# EasyEDA Pro project Modular-USB-Hub (All PCBs).epro

# Board PCB1
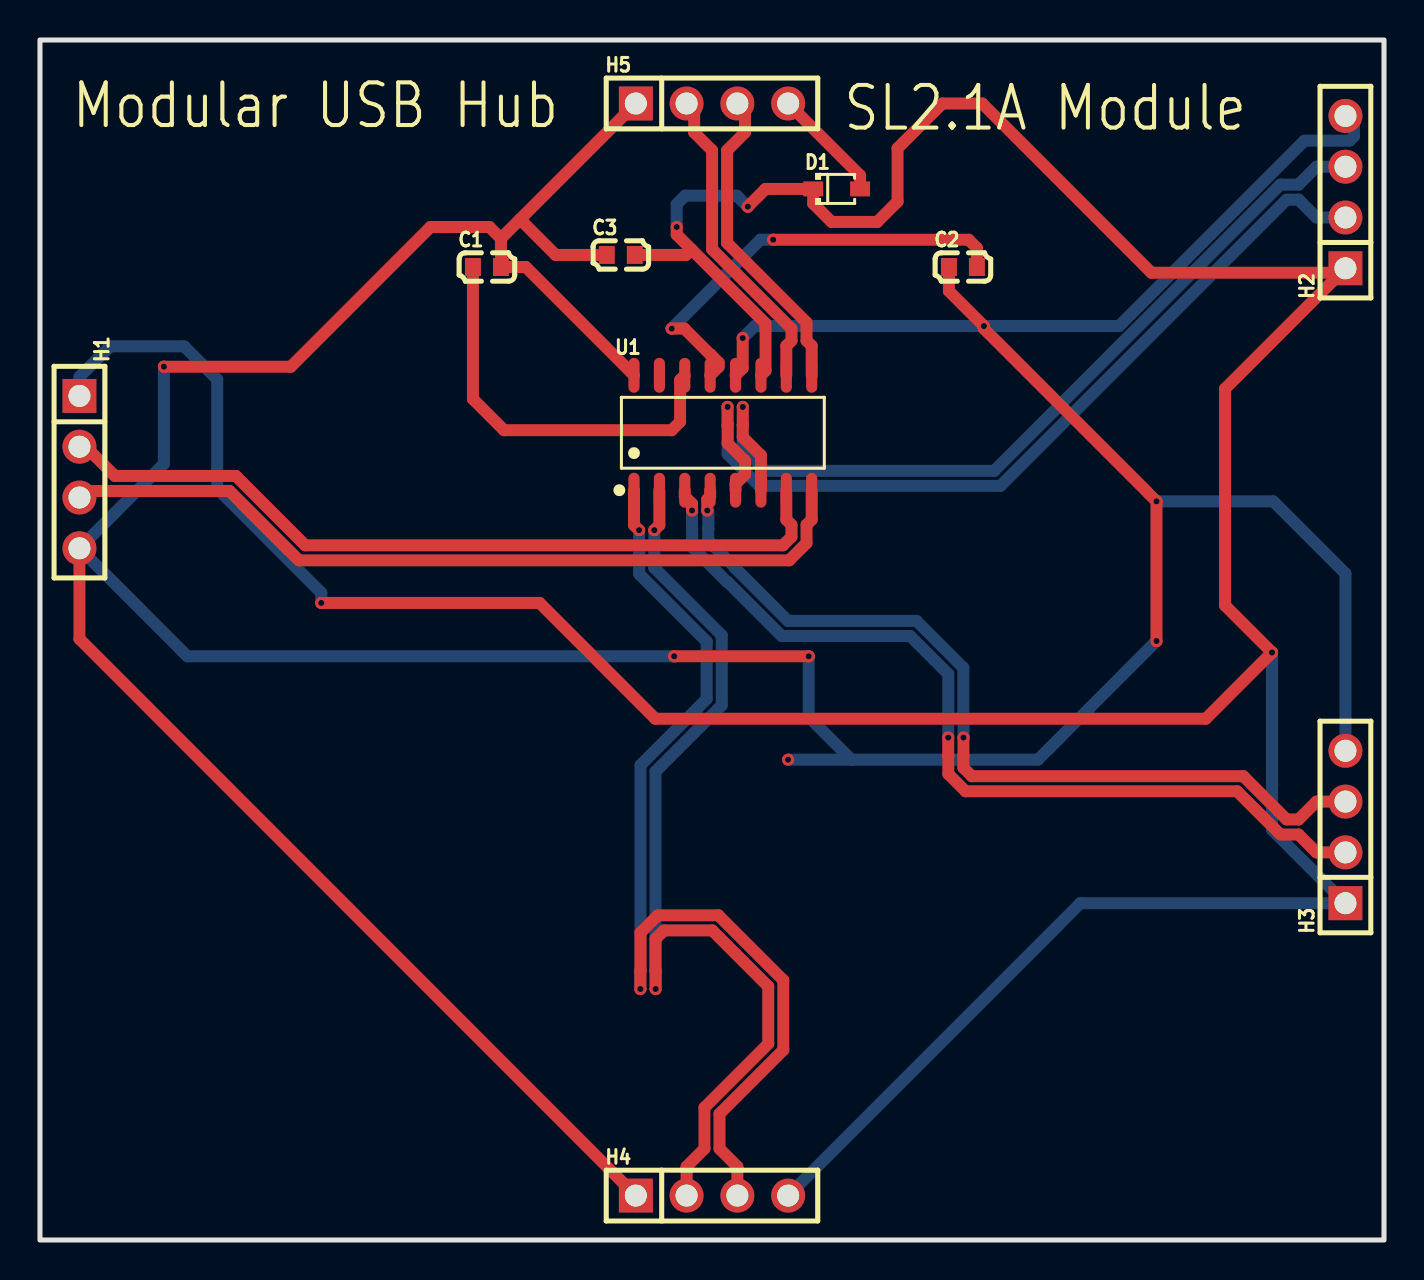
[diagram p0: board, top side]
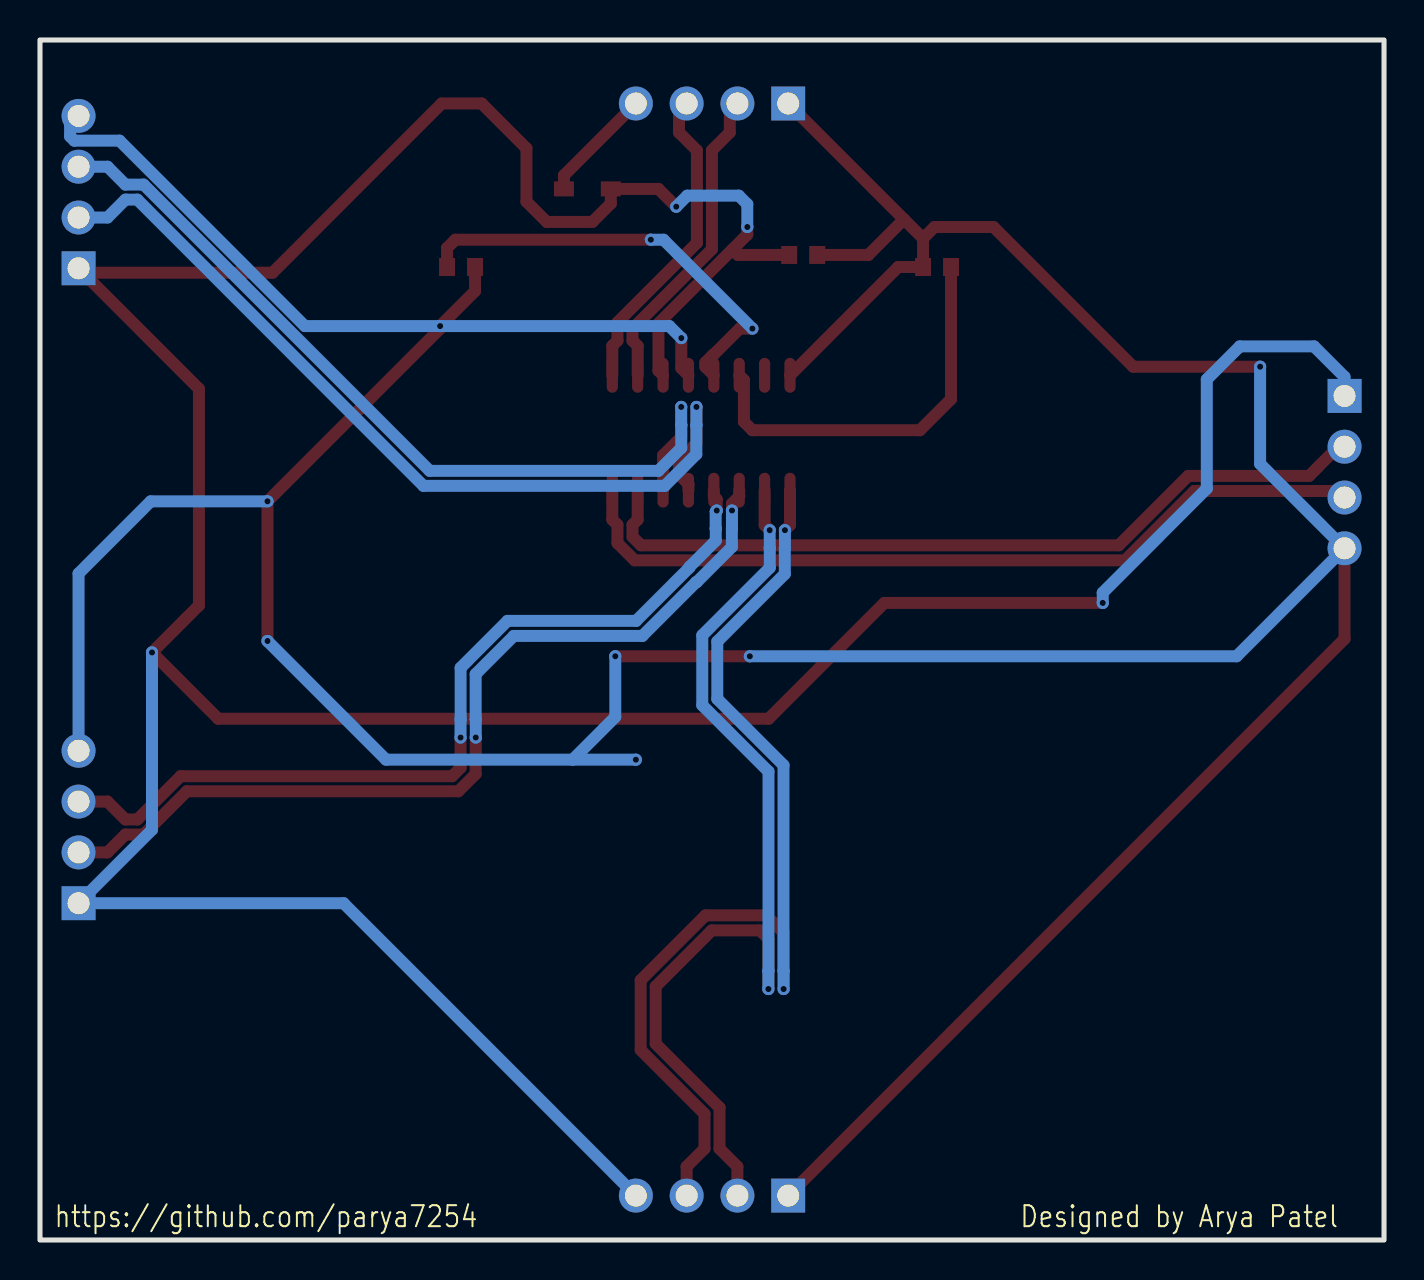
[diagram p1: board, bottom side, seen from below]

Outline 67.24 x 60 mm; copper layers: Top Layer, Bottom Layer. Coordinates in mm from the lower left corner of the outline.
Outline path: rectangle 0,60 67.24,0
Stack: Top Layer 0.035mm / Dielectric1 1.51mm FR4 er 4.5 / Bottom Layer 0.035mm

## Design rules (mm)
net M1: DP2
net P1: DP2
net M2: DP3
net P2: DP3
net M3: DP4
net P3: DP4
net M4: DP5
net P4: DP5
net $1N502: DP1
net $1N508: DP1
template: Custom Config
spacing copperThickness1oz (default): track to track 0.102, other pairs 0.152 to 0.3
spacing copperThickness2oz: track to track 0.203, other pairs 0.152 to 0.3
track width copperThickness1oz (default): min 0.127, default 0.254, max 2.54
track width copperThickness2oz: min 0.203, default 0.254, max 2.54
differential pair differentialPair (default): width min 0.127, default 0.254, max 2.54; gap min 0.152, default 0.152
via viaSize (default): diameter min 0.5, default 0.61, max 10; hole min 0.3, default 0.305, max 6.3

## Placement (name value [footprint] x y rotation side)
C1  10uF  [C0603]  22.36 48.65 0 top
C2  10uF  [C0603]  46.17 48.65 0 top
C3  10uF  [C0603]  29.06 49.25 0 top
D1  NSR0320MW2T1G  [SOD-323_L1.8-W1.3-LS2.5-RD]  39.85 52.55 0 top
H1  2.54-1*4P母  [HDR-TH_4P-P2.54-V-F]  1.98 38.39 270 top
H2  2.54-1*4P母  [HDR-TH_4P-P2.54-V-F]  65.31 52.39 90 top
H3  2.54-1*4P母  [HDR-TH_4P-P2.54-V-F]  65.31 20.65 90 top
H4  2.54-1*4P母  [HDR-TH_4P-P2.54-V-F]  33.62 2.22 0 top
H5  2.54-1*4P母  [HDR-TH_4P-P2.54-V-F]  33.62 56.83 0 top
U1  SL2.1A  [SOP-16_L10.0-W3.9-P1.27-LS6.0-BL]  34.16 40.36 0 top

## Footprints (pads in the part's own frame, mm; a bottom-side part is the same pattern mirrored in y, then rotated)
C0603
  rect 0.8x0.9 smd: 1(-0.7,0) 2(0.7,0)
HDR-TH_4P-P2.54-V-F
  rect 1.7x1.7 hole 1.1: 1(-3.81,0)
  round 1.7 hole 1.1: 2(-1.27,0) 3(1.27,0) 4(3.81,0)
SOD-323_L1.8-W1.3-LS2.5-RD
  rect 1x0.75 smd: 1(-1.173,0) 2(1.173,0)
SOP-16_L10.0-W3.9-P1.27-LS6.0-BL
  oval 0.56x1.745 smd: 1(-4.445,-2.873) 2(-3.175,-2.873) 3(-1.905,-2.873) 4(-0.635,-2.873) 5(0.635,-2.873) 6(1.905,-2.873) 7(3.175,-2.873) 8(4.445,-2.873) 9(4.445,2.873) 10(3.175,2.873) 11(1.905,2.873) 12(0.635,2.873) 13(-0.635,2.873) 14(-1.905,2.873) 15(-3.175,2.873) 16(-4.445,2.873)

## Nets
+5V: C3.2 D1.1 H1.1 H2.1 H3.1 H4.4 U1.11
GND: C1.2 C2.1 C3.1 H1.4 H2.4 H3.4 H4.1 H5.1 U1.12 U1.16
M1: H1.2 U1.7
M2: H2.2 U1.5
M3: H3.2 U1.3
M4: H4.3 U1.1
P1: H1.3 U1.8
P2: H2.3 U1.6
P3: H3.3 U1.4
P4: H4.2 U1.2
$1N261: C1.1 U1.14
$1N262: C2.2 U1.13
$1N502: H5.2 U1.10
$1N508: H5.3 U1.9
$1N3196: D1.2 H5.4

Pads without a net: U1 15

## Via types
v1: diameter 0.61, hole 0.305, Top Layer to Bottom Layer, 24 vias

## Routing (per net, layer and track width the routed paths; a pad name or vN(x,y) marks a point on that pad's centre or on a via; arc(x,y) is an arc through that point)
+5V: length 200.6
  Top Layer w0.6: 65.09,48.36 H2.1 ; 65.09,48.36 59.29,42.56 59.29,31.73 v1(61.64,29.38) 58.32,26.06 30.79,26.06 25,31.85 v1(14.07,31.85) ; 65.09,48.36 55.6,48.36 47.14,56.83 45.14,56.83 42.9,54.59 42.9,51.92 41.89,50.9 39.6,50.9 38.68,51.82 D1.1 36.3,52.55 v1(35.41,51.67) ; v1(31.85,50.65) 31.85,50.27 32.6,49.53 ; 32.6,49.53 36.3,45.82 36.3,43.47 U1.11 ; 32.6,49.53 32.32,49.25 C3.2
  Bottom Layer w0.6: H4.4 52.05,16.84 H3.1 61.64,20.51 v1(61.64,29.38) ; v1(35.41,51.67) 34.86,52.22 32.28,52.22 31.85,51.79 v1(31.85,50.65) ; v1(14.07,31.85) 14.07,32.36 8.87,37.57 8.87,43.03 7.22,44.68 3.5,44.68 1.98,43.16 H1.1
GND: length 246.1
  Top Layer w0.6: 24.02,51.03 25.8,49.25 C3.1 ; 24.02,51.03 29.81,56.83 ; 24.02,51.03 23.06,50.08 ; 23.06,50.08 22.49,50.65 19.53,50.65 12.55,43.66 v1(6.2,43.66) ; 23.06,50.08 C1.2 24.3,48.65 U1.16 ; v1(31.73,29.19) v1(38.46,29.19) ; v1(35.16,45.1) 35.16,43.59 U1.12 ; H4.1 1.98,30.05 H1.4 ; C2.1 45.47,47.44 v1(47.22,45.7) 47.22,45.57 v1(55.86,36.93) v1(55.86,29.95)
  Bottom Layer w0.6: 40.59,24.02 49.92,24.02 v1(55.86,29.95) ; 40.59,24.02 v1(37.43,24.02) ; 40.59,24.02 38.46,26.15 v1(38.46,29.19) ; v1(55.86,36.93) 61.7,36.93 65.31,33.32 65.31,24.46 ; v1(6.2,43.66) 6.2,38.81 H1.4 7.37,29.19 v1(31.73,29.19) ; v1(35.16,45.1) 35.76,45.7 v1(47.22,45.7) 53.99,45.7 63.26,54.97 65.52,54.97 65.73,55.18 65.73,55.78 H2.4
M1: length 40.3
  Top Layer w0.6: U1.7 37.34,36.02 37.6,35.76 37.6,35.16 37.17,34.73 13.27,34.73 9.8,38.2 3.75,38.2 2.29,39.66 H1.2
M2: length 45
  Top Layer w0.6: U1.5 34.8,37.8 35.28,38.28 35.28,38.96 34.4,39.83 34.4,40.74 34.4,40.75 v1(34.4,41.65)
  Bottom Layer w0.6: 65.31,51.12 63.86,51.12 62.96,52.02 62.36,52.02 48.05,37.7 35.99,37.7 34.4,39.29 34.4,40.74 34.4,40.75 v1(34.4,41.65)
M3: length 44.9
  Top Layer w0.6: v1(45.44,25.12) 45.44,24.22 45.44,24.21 45.44,23.3 46.31,22.44 59.89,22.44 62.05,20.27 62.96,20.27 63.86,19.38 65.31,19.38 ; v1(32.62,36.47) 32.62,36.82 32.26,37.18 U1.3
  Bottom Layer w0.6: v1(32.62,36.47) 32.62,35.57 32.62,35.56 32.62,34.65 34.38,32.89 34.41,32.89 37.1,30.2 43.54,30.2 45.44,28.3 45.44,26.03 45.44,26.03 v1(45.44,25.12)
M4: length 51.9
  Top Layer w0.6: H4.3 34.89,3.67 33.99,4.56 33.99,6.31 37.19,9.5 37.19,12.99 33.94,16.23 30.91,16.23 30.04,15.37 30.04,13.46 30.04,13.45 v1(30.04,12.55) ; v1(29.97,35.49) 29.72,35.75 U1.1
  Bottom Layer w0.6: v1(30.04,12.55) 30.04,13.45 30.04,13.46 30.04,23.74 33.35,27.05 33.35,29.92 29.98,33.3 29.98,34.58 29.97,34.59 v1(29.97,35.49)
P1: length 41.1
  Top Layer w0.6: 1.98,37.12 2.29,37.12 2.61,37.45 9.49,37.45 12.96,33.98 37.48,33.98 38.35,34.85 38.35,35.76 38.61,36.02 U1.8
P2: length 43.5
  Top Layer w0.6: v1(35.16,41.65) 35.16,40.75 35.16,40.74 35.16,40.14 36.07,39.23 U1.6
  Bottom Layer w0.6: v1(35.16,41.65) 35.16,40.75 35.16,40.74 35.16,39.6 36.3,38.46 47.74,38.46 62.05,52.77 62.96,52.77 63.86,53.66 H2.3
P3: length 43.6
  Top Layer w0.6: H3.3 63.86,21.92 62.96,21.03 62.36,21.03 60.2,23.19 46.62,23.19 46.2,23.61 46.2,24.21 46.2,24.22 v1(46.2,25.12) ; U1.4 33.53,37.18 33.38,37.03 v1(33.38,36.47)
  Bottom Layer w0.6: v1(33.38,36.47) 33.44,36.42 33.44,35.57 33.43,35.57 33.43,34.97 34.75,33.65 34.75,33.62 37.42,30.95 43.85,30.95 46.2,28.61 46.2,26.03 46.2,26.03 v1(46.2,25.12)
P4: length 49.5
  Top Layer w0.6: H4.2 32.35,3.67 33.24,4.56 33.24,6.62 36.43,9.81 36.43,12.68 33.63,15.48 31.22,15.48 30.79,15.06 30.79,13.46 30.8,13.45 v1(30.8,12.55) ; U1.2 30.99,35.75 v1(30.73,35.49)
  Bottom Layer w0.6: v1(30.8,12.55) 30.8,13.45 30.79,13.46 30.79,23.43 34.11,26.74 34.11,30.24 30.73,33.61 30.73,34.58 30.73,34.59 v1(30.73,35.49)
$1N261: length 20.2
  Top Layer w0.6: C1.1 21.66,42.05 23.22,40.49 31.6,40.49 32.02,40.91 32.02,43 U1.14
$1N262: length 22.1
  Top Layer w0.6: v1(31.6,45.57) 32.23,45.57 33.54,44.26 33.57,44.26 33.95,43.88 33.95,43.66 U1.13 ; v1(36.68,50.01) 46.46,50.01 46.87,49.6 C2.2
  Bottom Layer w0.6: v1(31.6,45.57) 36.04,50.01 v1(36.68,50.01)
$1N502: length 15.7
  Top Layer w0.6: 32.73,56.83 32.73,55.38 33.62,54.48 33.62,49.54 37.6,45.57 37.6,44.97 37.34,44.71 U1.10
$1N508: length 15.7
  Top Layer w0.6: 35.27,56.83 35.27,55.38 34.38,54.48 34.38,49.85 38.35,45.88 38.35,44.97 38.61,44.71 U1.9
$1N3196: length 5.8
  Top Layer w0.6: D1.2 41.03,53.23 H5.4

## Text on the board
Bottom Silkscreen Layer: Designed by Arya Patel | https://github.com/parya7254
Top Silkscreen Layer: Modular USB Hub | SL2.1A Module

# Board PCB2
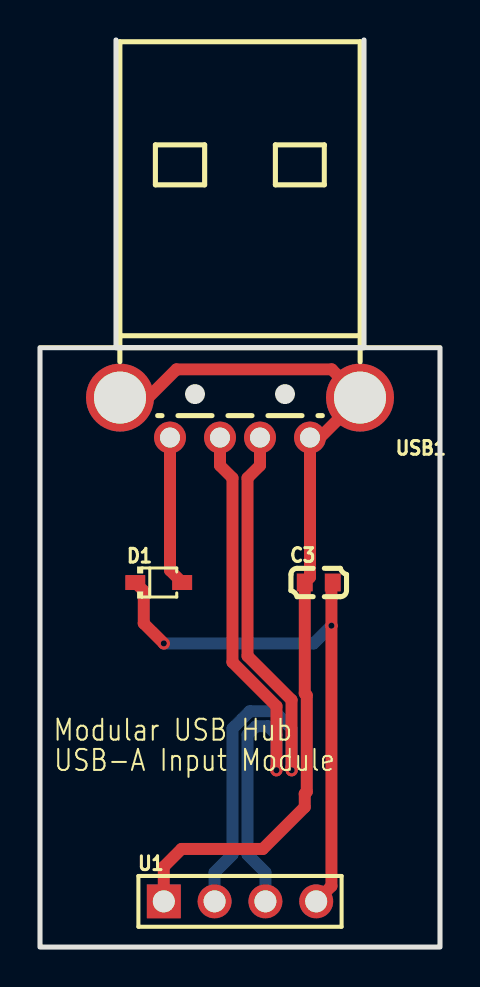
[diagram p2: board, top side]
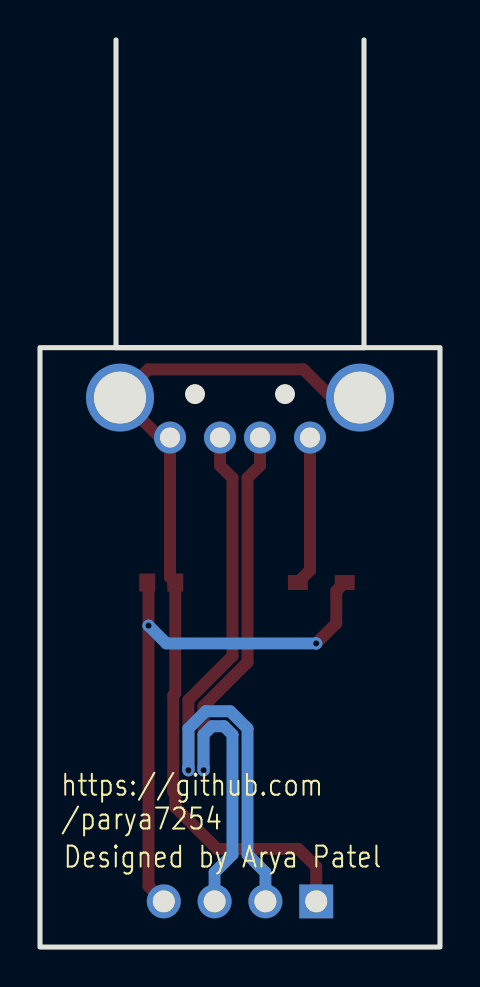
[diagram p3: board, bottom side, seen from below]

Outline 20 x 45.4 mm; copper layers: Top Layer, Bottom Layer. Coordinates in mm from the lower left corner of the outline.
Outline path: rectangle 0,30 20,0
Stack: Top Layer 0.035mm / Dielectric1 1.51mm FR4 er 4.5 / Bottom Layer 0.035mm

## Design rules (mm)
net $1N619: DP1
net $1N627: DP1
template: Custom Config
spacing copperThickness1oz (default): track to track 0.102, other pairs 0.152 to 0.3
spacing copperThickness2oz: track to track 0.203, other pairs 0.152 to 0.3
track width copperThickness1oz (default): min 0.127, default 0.254, max 2.54
track width copperThickness2oz: min 0.203, default 0.254, max 2.54
differential pair differentialPair (default): width min 0.127, default 0.254, max 2.54; gap min 0.152, default 0.152
via viaSize (default): diameter min 0.5, default 0.61, max 10; hole min 0.3, default 0.305, max 6.3

## Placement (name value [footprint] x y rotation side)
C3  10uF  [C0603]  13.94 18.24 0 top
D1  NSR0320MW2T1G  [SOD-323_L1.8-W1.3-LS2.5-RD]  5.94 18.24 0 top
U1  2.54-1*4  [HDR-TH_4P-P2.54-V-M-1]  10 2.29 0 top
USB1  AM90  [USB-AM-TH_AM90]  10 26.5 180 top

## Footprints (pads in the part's own frame, mm; a bottom-side part is the same pattern mirrored in y, then rotated)
C0603
  rect 0.8x0.9 smd: 1(-0.7,0) 2(0.7,0)
HDR-TH_4P-P2.54-V-M-1
  rect 1.7x1.7 hole 1.1: 1(-3.81,0)
  round 1.7 hole 1.1: 2(-1.27,0) 3(1.27,0) 4(3.81,0)
SOD-323_L1.8-W1.3-LS2.5-RD
  rect 1x0.75 smd: 1(-1.173,0) 2(1.173,0)
USB-AM-TH_AM90
  round 1.6 hole 1: 1(3.5,1) 2(1,1) 3(-1,1) 4(-3.5,1)
  round 3.4 hole 2.6: MH1(6,-1) MH2(-6,-1)

## Nets
+5V: C3.2 D1.1 U1.4
GND: C3.1 U1.1 USB1.4 USB1.MH1 USB1.MH2
$1N582: D1.2 USB1.1
$1N619: U1.2 USB1.3
$1N627: U1.3 USB1.2

## Via types
v1: diameter 0.61, hole 0.305, Top Layer to Bottom Layer, 4 vias

## Routing (per net, layer and track width the routed paths; a pad name or vN(x,y) marks a point on that pad's centre or on a via; arc(x,y) is an arc through that point)
+5V: length 28.7
  Top Layer w0.6: U1.4 14.57,3.05 v1(14.57,16.09) 14.57,18.18 C3.2 ; D1.1 5.19,17.82 5.19,16.2 v1(6.19,15.2)
  Bottom Layer w0.6: v1(6.19,15.2) 13.68,15.2 v1(14.57,16.09)
GND: length 45.2
  Top Layer w0.6: USB1.MH1 5.41,27.5 6.83,28.91 14.59,28.91 USB1.MH2 14,25.5 USB1.4 13.5,18.51 C3.1 13.24,12.7 13.34,12.6 13.34,7.77 13.24,7.67 13.24,7 11.14,4.91 7.08,4.91 6.19,4.02 U1.1
$1N582: length 7.5
  Top Layer w0.6: D1.2 6.5,18.85 USB1.1
$1N619: length 32.6
  Top Layer w0.6: USB1.3 11,24.1 10.38,23.48 10.38,14.57 12.58,12.37 12.58,8.99 12.58,8.99 v1(12.58,8.85)
  Bottom Layer w0.6: v1(12.58,8.85) 12.58,8.99 12.58,8.99 12.58,10.94 11.71,11.8 10.49,11.8 9.62,10.94 9.62,4.63 8.73,3.74 U1.2
$1N627: length 30.1
  Top Layer w0.6: v1(11.82,8.85) 11.82,8.99 11.82,8.99 11.82,12.05 9.62,14.25 9.62,23.48 9,24.1 USB1.2
  Bottom Layer w0.6: v1(11.82,8.85) 11.82,8.99 11.82,8.99 11.82,10.62 11.4,11.05 10.8,11.05 10.38,10.62 10.38,4.63 11.27,3.74 U1.3

## Text on the board
Bottom Silkscreen Layer: Designed by Arya Patel | https://github.com / /parya7254
Top Silkscreen Layer: Modular USB Hub | USB-A Input Module

# Board PCB4
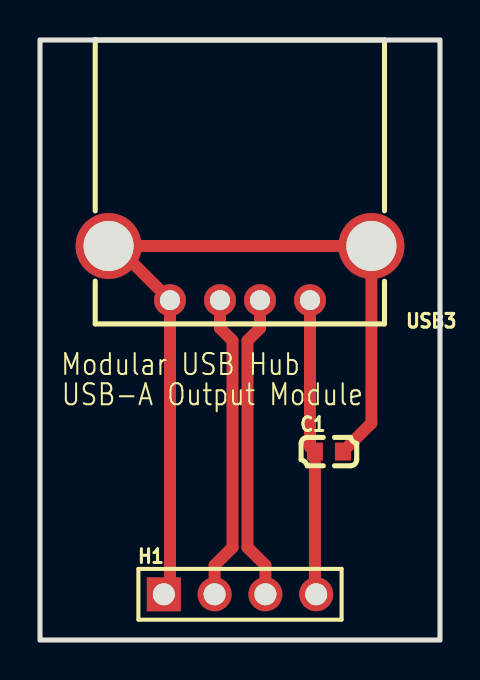
[diagram p4: board, top side]
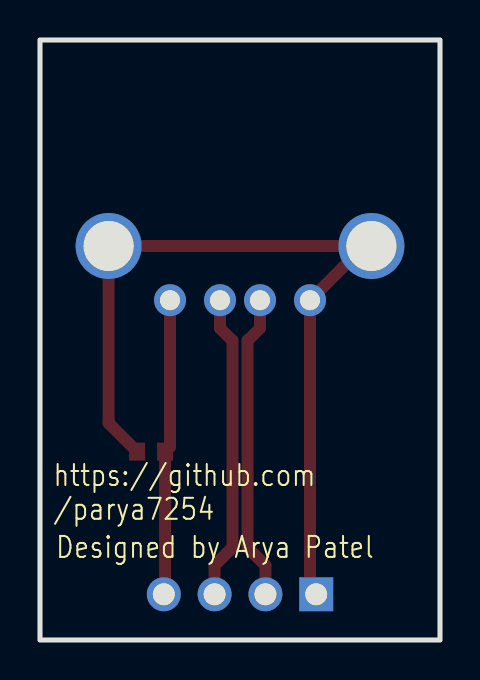
[diagram p5: board, bottom side, seen from below]

Outline 20 x 30 mm; copper layers: Top Layer, Bottom Layer. Coordinates in mm from the lower left corner of the outline.
Outline path: rectangle 0,30 20,0
Stack: Top Layer 0.035mm / Dielectric1 1.51mm FR4 er 4.5 / Bottom Layer 0.035mm

## Design rules (mm)
net M: DP1
net P: DP1
template: Custom Config
spacing copperThickness1oz (default): track to track 0.102, other pairs 0.152 to 0.3
spacing copperThickness2oz: track to track 0.203, other pairs 0.152 to 0.3
track width copperThickness1oz (default): min 0.127, default 0.254, max 2.54
track width copperThickness2oz: min 0.203, default 0.254, max 2.54
differential pair differentialPair (default): width min 0.127, default 0.254, max 2.54; gap min 0.152, default 0.152
via viaSize (default): diameter min 0.5, default 0.61, max 10; hole min 0.3, default 0.305, max 6.3

## Placement (name value [footprint] x y rotation side)
C1  10uF  [C0603]  14.45 9.42 0 top
H1  2.54-1*4  [HDR-TH_4P-P2.54-V-M-1]  10 2.29 0 top
USB3  USB-231-ARY  [USB-A-TH_USB-231-ARY]  10 18.34 180 top

## Footprints (pads in the part's own frame, mm; a bottom-side part is the same pattern mirrored in y, then rotated)
C0603
  rect 0.8x0.9 smd: 1(-0.7,0) 2(0.7,0)
HDR-TH_4P-P2.54-V-M-1
  rect 1.7x1.7 hole 1.1: 1(-3.81,0)
  round 1.7 hole 1.1: 2(-1.27,0) 3(1.27,0) 4(3.81,0)
USB-A-TH_USB-231-ARY
  round 1.6 hole 1: 1(-3.5,1.355) 2(-1,1.355) 3(1,1.355) 4(3.5,1.355)
  round 3.3 hole 2.5: 5(-6.57,-1.355) 6(6.57,-1.355)

## Nets
+5V: C1.1 H1.4 USB3.1
GND: C1.2 H1.1 USB3.4 USB3.5 USB3.6
M: H1.3 USB3.2
P: H1.2 USB3.3

## Routing (per net, layer and track width the routed paths; a pad name or vN(x,y) marks a point on that pad's centre or on a via; arc(x,y) is an arc through that point)
+5V: length 14.8
  Top Layer w0.6: H1.4 13.75,2.35 C1.1 13.5,9.67 USB3.1
GND: length 42.7
  Top Layer w0.6: 3.79,19.7 USB3.6 ; 3.79,19.7 USB3.4 6.5,2.6 H1.1 ; 3.79,19.7 USB3.5 16.57,10.84 C1.2
M: length 15.3
  Top Layer w0.6: USB3.2 11,15.59 10.38,14.97 10.38,4.63 11.27,3.74 H1.3
P: length 15.3
  Top Layer w0.6: USB3.3 9,15.59 9.62,14.97 9.62,4.63 8.73,3.74 H1.2

## Text on the board
Bottom Silkscreen Layer: Designed by Arya Patel | https://github.com / /parya7254
Top Silkscreen Layer: Modular USB Hub | USB-A Output Module

# Board PCB3
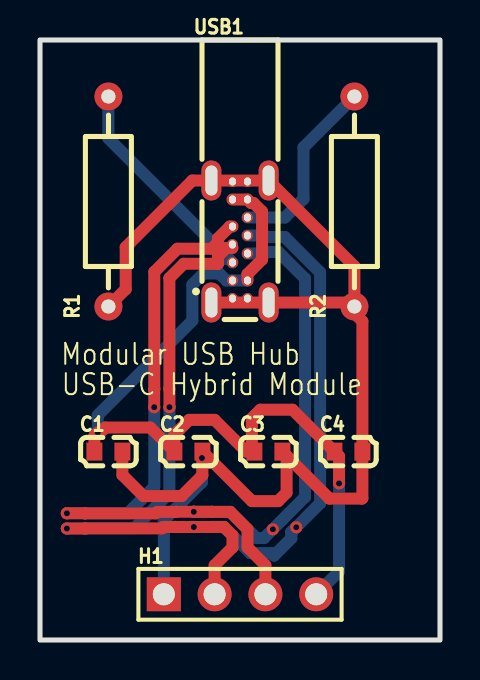
[diagram p6: board, top side]
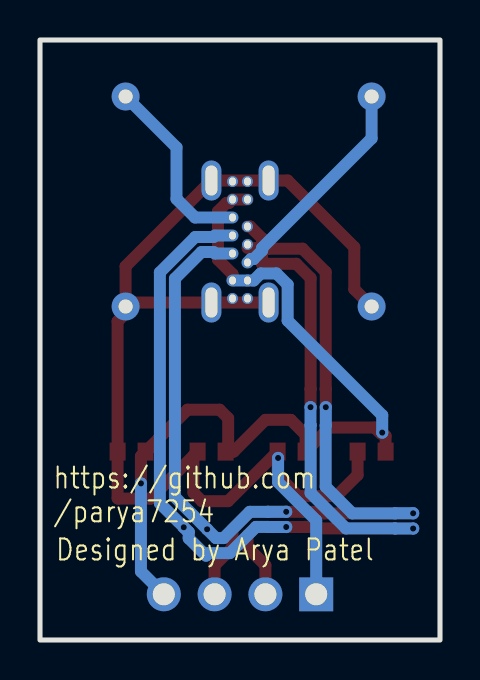
[diagram p7: board, bottom side, seen from below]

Outline 20 x 30 mm; copper layers: Top Layer, Bottom Layer. Coordinates in mm from the lower left corner of the outline.
Outline path: rectangle 0,30 20,0
Stack: Top Layer 0.035mm / Dielectric1 1.51mm FR4 er 4.5 / Bottom Layer 0.035mm

## Design rules (mm)
net M: DP1
net P: DP1
template: Custom Config
spacing copperThickness1oz (default): track to track 0.102, other pairs 0.152 to 0.3
spacing copperThickness2oz: track to track 0.203, other pairs 0.152 to 0.3
track width copperThickness1oz (default): min 0.127, default 0.254, max 2.54
track width copperThickness2oz: min 0.203, default 0.254, max 2.54
differential pair differentialPair (default): width min 0.127, default 0.254, max 2.54; gap min 0, default 0.152
via viaSize (default): diameter min 0.5, default 0.61, max 10; hole min 0.3, default 0.305, max 6.3

## Placement (name value [footprint] x y rotation side)
C1  10uF  [C0603]  3.42 9.42 0 top
C2  10uF  [C0603]  7.42 9.42 0 top
C3  10uF  [C0603]  11.42 9.42 0 top
C4  10uF  [C0603]  15.42 9.42 0 top
H1  2.54-1*4  [HDR-TH_4P-P2.54-V-M-1]  10 2.29 0 top
R1  5.1kΩ  [RES-TH_BD2.3-L6.5-P10.50-D0.5]  3.42 21.92 90 top
R2  5.1kΩ  [RES-TH_BD2.3-L6.5-P10.50-D0.5]  15.72 21.92 90 top
USB1  KH-TYPE-C-CY-14P  [USB-C-TH_KH-TYPE-C-CY-14P]  10 19.92 0 top

## Footprints (pads in the part's own frame, mm; a bottom-side part is the same pattern mirrored in y, then rotated)
C0603
  rect 0.8x0.9 smd: 1(-0.7,0) 2(0.7,0)
HDR-TH_4P-P2.54-V-M-1
  rect 1.7x1.7 hole 1.1: 1(-3.81,0)
  round 1.7 hole 1.1: 2(-1.27,0) 3(1.27,0) 4(3.81,0)
RES-TH_BD2.3-L6.5-P10.50-D0.5
  round 1.4 hole 0.7: 1(-5.25,0) 2(5.25,0)
USB-C-TH_KH-TYPE-C-CY-14P
  round 0.55 hole 0.35x0.4: 1(-0.375,-2.85) 2(0.375,-2.85) 3(-0.375,-1.95) 4(0.375,-1.95) 5(-0.375,-1.05) 6(0.375,-0.6) 7(-0.38,-0.15) 8(0.375,0.3) 9(-0.375,0.75) 10(0.375,1.2) 11(-0.375,2.1) 12(0.375,2.1) 13(0.375,3) 14(-0.375,3)
  oval 1x2 hole 0.6x1.5: 15(-1.43,3.05) 16(1.43,3.05) 17(-1.43,-3.05) 18(1.43,-3.05)

## Nets
+5V: C1.1 C2.1 C3.1 C4.1 H1.4 USB1.3 USB1.4 USB1.11 USB1.12
GND: C1.2 C2.2 C3.2 C4.2 H1.1 R1.1 R2.1 USB1.1 USB1.2 USB1.13 USB1.14 USB1.15 USB1.16 USB1.17 USB1.18
M: H1.3 USB1.6 USB1.9
P: H1.2 USB1.7 USB1.8
$1N739: R1.2 USB1.5
$1N778: R2.2 USB1.10

## Via types
v1: diameter 0.61, hole 0.305, Top Layer to Bottom Layer, 11 vias

## Routing (per net, layer and track width the routed paths; a pad name or vN(x,y) marks a point on that pad's centre or on a via; arc(x,y) is an arc through that point)
+5V: length 43.8
  Top Layer w0.6: 10.38,17.98 10.38,18.3 11.1,19.02 11.1,21.43 10.68,21.85 10.55,21.85 USB1.12 USB1.11 ; 2.95,10.31 3.27,10.62 5.52,10.62 C2.1 6.72,10.27 7.46,11.01 8.73,11.01 10.32,9.42 C3.1 10.59,9.55 10.59,11.09 11.02,11.51 12.63,11.51 C4.1 14.95,9.19 v1(14.95,7.83) ; C1.1 2.72,10.2 v1(2.89,10.37)
  Bottom Layer w0.6: v1(2.89,10.37) 2.89,11.24 7.62,15.97 7.62,17.77 8.18,18.33 8.96,18.33 9.32,17.98 10.38,17.98 ; v1(14.95,7.83) 14.95,3.43 H1.4
GND: length 64
  Top Layer w0.6: 12.33,9.21 14.47,7.07 16.1,7.07 16.12,7.09 C4.2 16.12,15.94 15.46,16.59 ; 12.33,9.21 C3.2 ; 12.33,9.21 12.33,7.37 11.91,6.94 10.6,6.94 C2.2 8.12,9.13 ; R1.1 4.29,17.54 4.29,19.64 7.62,22.98 11.43,22.98 15.72,18.69 R2.1 15.52,16.88 USB1.18 USB1.17 ; 8.12,9.13 8.12,8.24 7.08,7.2 5.17,7.2 4.12,8.25 C1.2 ; 8.12,9.13 v1(8.09,9.1)
  Bottom Layer w0.6: H1.1 6.19,5.98 8.09,7.89 v1(8.09,9.1)
M: length 55
  Top Layer w0.6: v1(5.71,11.64) 5.71,12.55 5.72,12.55 5.72,18.41 6.87,19.56 8.58,19.56 8.89,19.88 8.89,20.08 9.49,20.67 USB1.9 ; v1(1.34,6.34) 2.25,6.34 2.25,6.33 5.79,6.33 5.87,6.41 6.78,6.41 6.78,6.41 v1(7.69,6.41) 8.59,6.41 8.6,6.41 9.51,6.41 10.38,5.54 10.38,4.63 11.27,3.74 H1.3
  Bottom Layer w0.6: v1(5.71,11.64) 5.71,10.74 5.72,10.73 5.72,7.66 4.39,6.33 2.25,6.33 2.25,6.34 v1(1.34,6.34) ; v1(7.69,6.41) 8.59,6.41 8.6,6.41 9.51,6.41 10.82,5.1 11.2,5.1 v1(11.64,5.54) 13.25,7.15 13.25,18.07 11.92,19.4 11.32,19.4 11.25,19.33 USB1.6
P: length 56.9
  Top Layer w0.6: v1(1.34,5.57) 2.25,5.57 2.25,5.58 6.1,5.58 6.18,5.65 6.78,5.65 6.78,5.65 v1(7.69,5.65) 8.59,5.65 8.6,5.65 9.2,5.65 9.62,5.23 9.62,4.63 8.73,3.74 H1.2 ; 9.62,19.6 9.32,19.6 8.9,19.18 8.9,18.82 8.89,18.81 7.19,18.81 6.47,18.09 6.47,12.55 6.47,12.55 v1(6.47,11.64)
  Bottom Layer w0.6: v1(6.47,11.64) 6.47,10.74 6.47,10.73 6.47,7.35 4.7,5.58 2.25,5.58 2.25,5.57 v1(1.34,5.57) ; 12.56,5.39 14.01,6.84 14.01,18.38 12.24,20.15 11.32,20.15 11.25,20.23 USB1.8 ; 12.56,5.39 12.57,5.39 v1(12.81,5.64) ; 12.56,5.39 12.56,5.08 11.7,4.22 11.57,4.34 10.51,4.34 9.2,5.65 8.6,5.65 8.59,5.65 v1(7.69,5.65)
$1N739: length 10.9
  Bottom Layer w0.6: USB1.5 9.45,19.05 9.32,19.05 8.89,19.47 8.89,19.61 3.42,25.08 R1.2
$1N778: length 9.4
  Bottom Layer w0.6: USB1.10 12.25,21.12 13.18,22.06 13.18,24.63 R2.2

## Text on the board
Bottom Silkscreen Layer: Designed by Arya Patel | https://github.com / /parya7254
Top Silkscreen Layer: Modular USB Hub | USB-C Hybrid Module
